# EAGLE design slice_noshift (EAGLE 5.11)

## Sheet 1 of 6
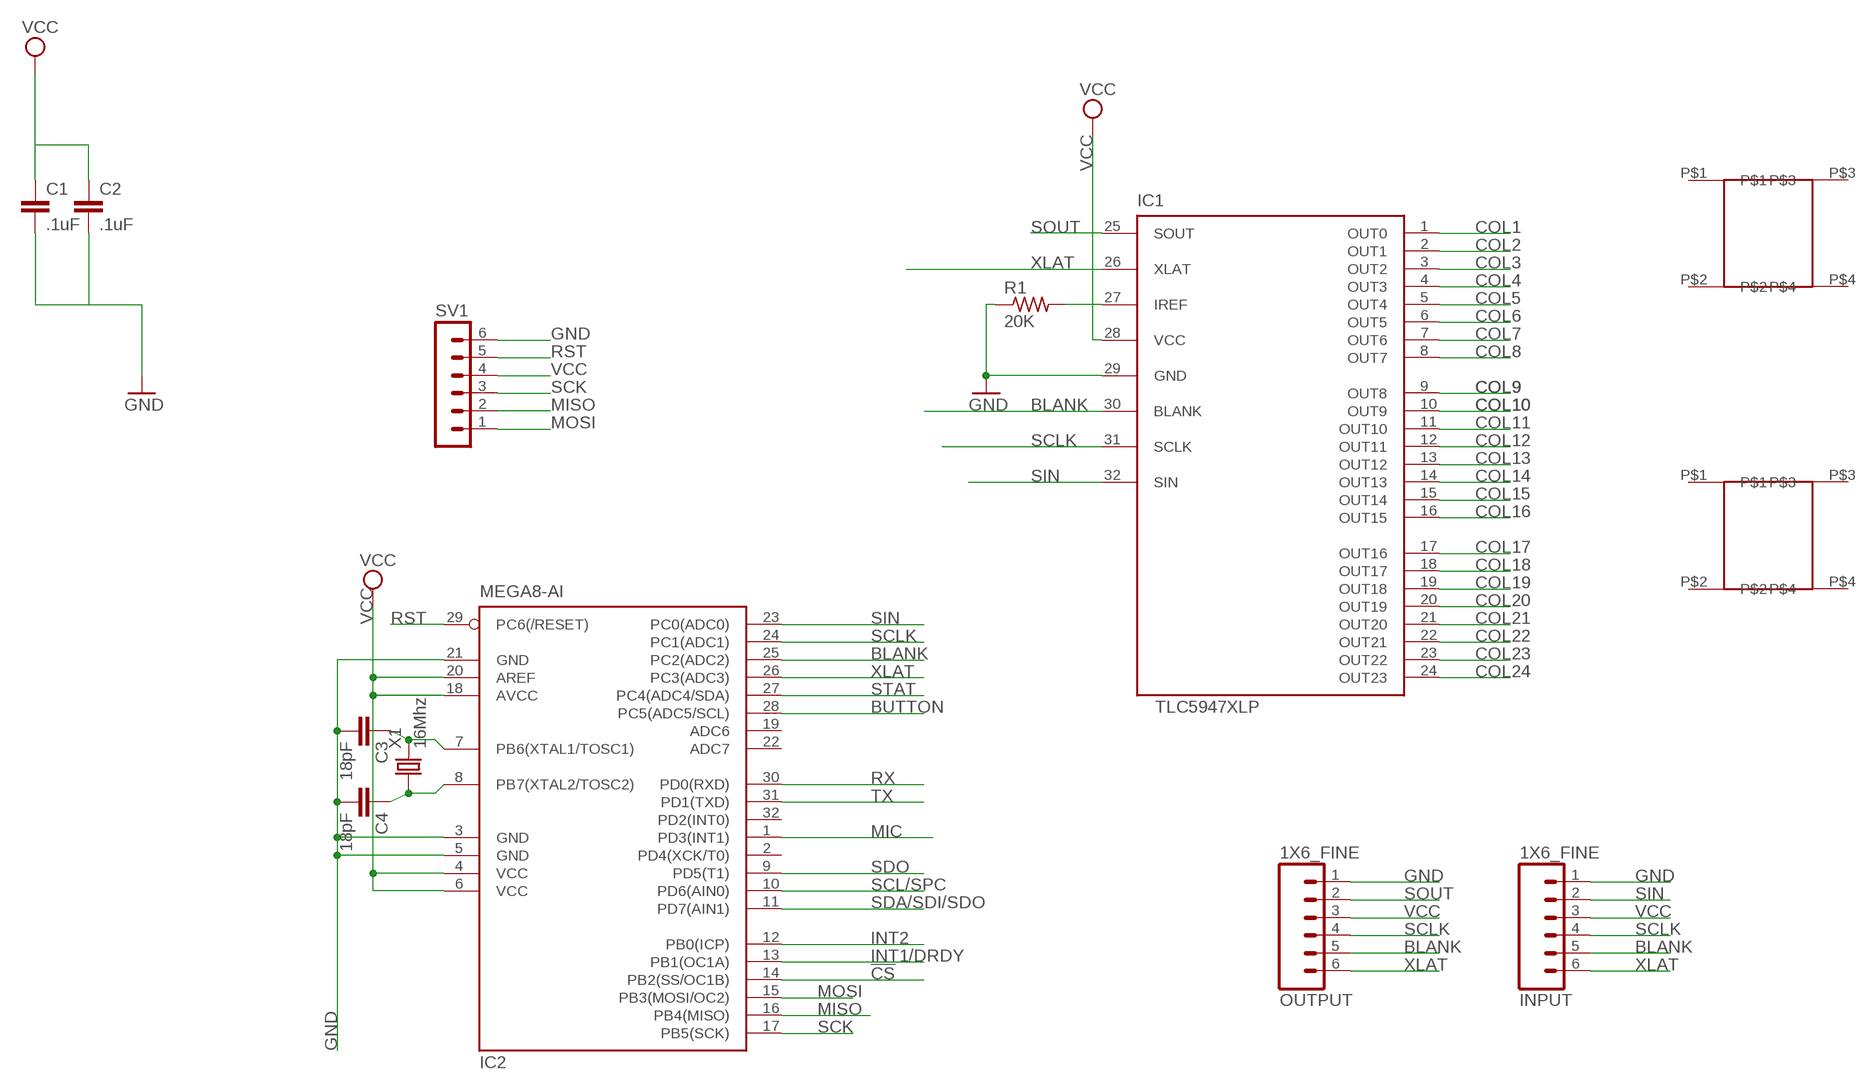
[diagram p0: schematic, sheet 1]

### Parts
C1  .1uF  CAP0805  [0805]
C2  .1uF  CAP0805  [0805]
C3  18pF  CAP0805  [0805]
C4  18pF  CAP0805  [0805]
IC1  TLC5947XLP  [QFN32_XLP]
IC2  MEGA8-AI  [TQFP32-08]
INPUT  1X6_FINE  [1X6_FINE]
OUTPUT  1X6_FINE  [1X6_FINE]
R1  20K  R-US_R0805  [R0805]
SLOT1  SLOT  [SLOT]
SLOT2  SLOT  [SLOT]
SV1  MA06-1  [MA06-1]
X1  16Mhz  CRYSTAL-5032  [5032]

### Nets
!CS: IC2.14(PB2(SS/OC1B)) ; also sheet 3
BLANK: IC1.30(BLANK) IC2.25(PC2(ADC2)) INPUT.5 OUTPUT.5
BUTTON: IC2.28(PC5(ADC5/SCL)) ; also sheet 3
COL1: IC1.1(OUT0) ; also sheet 2
COL2: IC1.2(OUT1) ; also sheet 2
COL3: IC1.3(OUT2) ; also sheet 2
COL4: IC1.4(OUT3) ; also sheet 2
COL5: IC1.5(OUT4) ; also sheet 2
COL6: IC1.6(OUT5) ; also sheet 2
COL7: IC1.7(OUT6) ; also sheet 2
COL8: IC1.8(OUT7) ; also sheet 2
COL9: IC1.9(OUT8) ; also sheet 2
COL10: IC1.10(OUT9) ; also sheet 2
COL11: IC1.11(OUT10) ; also sheet 2
COL12: IC1.12(OUT11) ; also sheet 2
COL13: IC1.13(OUT12) ; also sheet 2
COL14: IC1.14(OUT13) ; also sheet 2
COL15: IC1.15(OUT14) ; also sheet 2
COL16: IC1.16(OUT15) ; also sheet 2
COL17: IC1.17(OUT16) ; also sheet 2
COL18: IC1.18(OUT17) ; also sheet 2
COL19: IC1.19(OUT18) ; also sheet 2
COL20: IC1.20(OUT19) ; also sheet 2
COL21: IC1.21(OUT20) ; also sheet 2
COL22: IC1.22(OUT21) ; also sheet 2
COL23: IC1.23(OUT22) ; also sheet 2
COL24: IC1.24(OUT23) ; also sheet 2
GND: C1.2 C2.2 C3.2 C4.2 IC1.29(GND) IC2.3(GND) IC2.5(GND) IC2.21(GND) INPUT.1 OUTPUT.1 R1.1 SV1.6 ; also sheet 3,4,5,6
INT1/DRDY: IC2.13(PB1(OC1A)) ; also sheet 3
INT2: IC2.12(PB0(ICP)) ; also sheet 3
MIC: IC2.1(PD3(INT1)) ; also sheet 6
MISO: IC2.16(PB4(MISO)) SV1.2
MOSI: IC2.15(PB3(MOSI/OC2)) SV1.1
N$7: C3.1 IC2.7(PB6(XTAL1/TOSC1)) X1.2
N$8: C4.1 IC2.8(PB7(XTAL2/TOSC2)) X1.1
N$13: IC1.27(IREF) R1.2
RST: IC2.29(PC6(/RESET)) SV1.5 ; also sheet 3
RX: IC2.30(PD0(RXD)) ; also sheet 5
SCK: IC2.17(PB5(SCK)) SV1.3
SCL/SPC: IC2.10(PD6(AIN0)) ; also sheet 3
SCLK: IC1.31(SCLK) IC2.24(PC1(ADC1)) INPUT.4 OUTPUT.4
SDA/SDI/SDO: IC2.11(PD7(AIN1)) ; also sheet 3
SDO: IC2.9(PD5(T1)) ; also sheet 3
SIN: IC1.32(SIN) IC2.23(PC0(ADC0)) INPUT.2
SOUT: IC1.25(SOUT) OUTPUT.2
STAT: IC2.27(PC4(ADC4/SDA)) ; also sheet 4
TX: IC2.31(PD1(TXD)) ; also sheet 5
VCC: C1.1 C2.1 IC1.28(VCC) IC2.4(VCC) IC2.6(VCC) IC2.18(AVCC) IC2.20(AREF) INPUT.3 OUTPUT.3 SV1.4 ; also sheet 2,3,4,5,6
XLAT: IC1.26(XLAT) IC2.26(PC3(ADC3)) INPUT.6 OUTPUT.6
Unconnected: IC2.2(PD4(XCK/T0)) IC2.19(ADC6) IC2.22(ADC7) IC2.32(PD2(INT0)) SLOT1.P$1 SLOT1.P$2 SLOT1.P$3 SLOT1.P$4 SLOT2.P$1 SLOT2.P$2 SLOT2.P$3 SLOT2.P$4

## Sheet 2 of 6
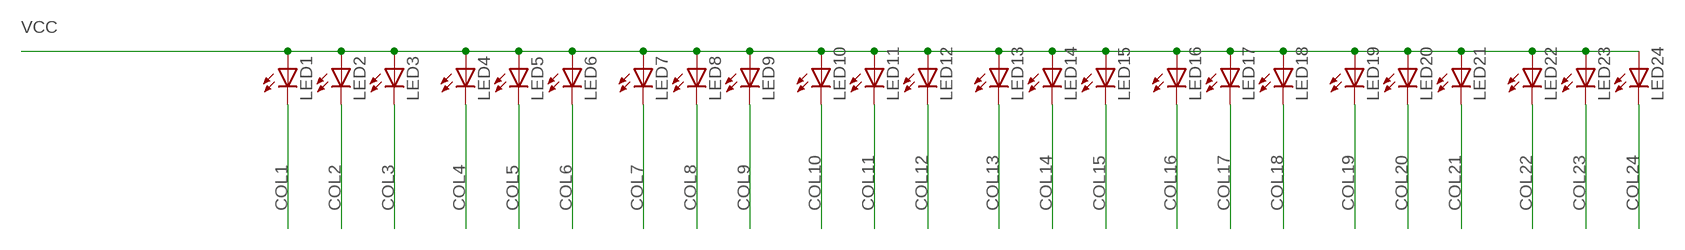
[diagram p1: schematic, sheet 2]

### Parts
LED1  LEDIRL80A  [IRL80A]
LED2  LEDIRL80A  [IRL80A]
LED3  LEDIRL80A  [IRL80A]
LED4  LEDIRL80A  [IRL80A]
LED5  LEDIRL80A  [IRL80A]
LED6  LEDIRL80A  [IRL80A]
LED7  LEDIRL80A  [IRL80A]
LED8  LEDIRL80A  [IRL80A]
LED9  LEDIRL80A  [IRL80A]
LED10  LEDIRL80A  [IRL80A]
LED11  LEDIRL80A  [IRL80A]
LED12  LEDIRL80A  [IRL80A]
LED13  LEDIRL80A  [IRL80A]
LED14  LEDIRL80A  [IRL80A]
LED15  LEDIRL80A  [IRL80A]
LED16  LEDIRL80A  [IRL80A]
LED17  LEDIRL80A  [IRL80A]
LED18  LEDIRL80A  [IRL80A]
LED19  LEDIRL80A  [IRL80A]
LED20  LEDIRL80A  [IRL80A]
LED21  LEDIRL80A  [IRL80A]
LED22  LEDIRL80A  [IRL80A]
LED23  LEDIRL80A  [IRL80A]
LED24  LEDIRL80A  [IRL80A]

### Nets
COL1: LED1.K(C) ; also sheet 1
COL2: LED2.K(C) ; also sheet 1
COL3: LED3.K(C) ; also sheet 1
COL4: LED4.K(C) ; also sheet 1
COL5: LED5.K(C) ; also sheet 1
COL6: LED6.K(C) ; also sheet 1
COL7: LED7.K(C) ; also sheet 1
COL8: LED8.K(C) ; also sheet 1
COL9: LED9.K(C) ; also sheet 1
COL10: LED10.K(C) ; also sheet 1
COL11: LED11.K(C) ; also sheet 1
COL12: LED12.K(C) ; also sheet 1
COL13: LED13.K(C) ; also sheet 1
COL14: LED14.K(C) ; also sheet 1
COL15: LED15.K(C) ; also sheet 1
COL16: LED16.K(C) ; also sheet 1
COL17: LED17.K(C) ; also sheet 1
COL18: LED18.K(C) ; also sheet 1
COL19: LED19.K(C) ; also sheet 1
COL20: LED20.K(C) ; also sheet 1
COL21: LED21.K(C) ; also sheet 1
COL22: LED22.K(C) ; also sheet 1
COL23: LED23.K(C) ; also sheet 1
COL24: LED24.K(C) ; also sheet 1
VCC: LED1.A LED2.A LED3.A LED4.A LED5.A LED6.A LED7.A LED8.A LED9.A LED10.A LED11.A LED12.A LED13.A LED14.A LED15.A LED16.A LED17.A LED18.A LED19.A LED20.A LED21.A LED22.A LED23.A LED24.A ; also sheet 1,3,4,5,6

## Sheet 3 of 6
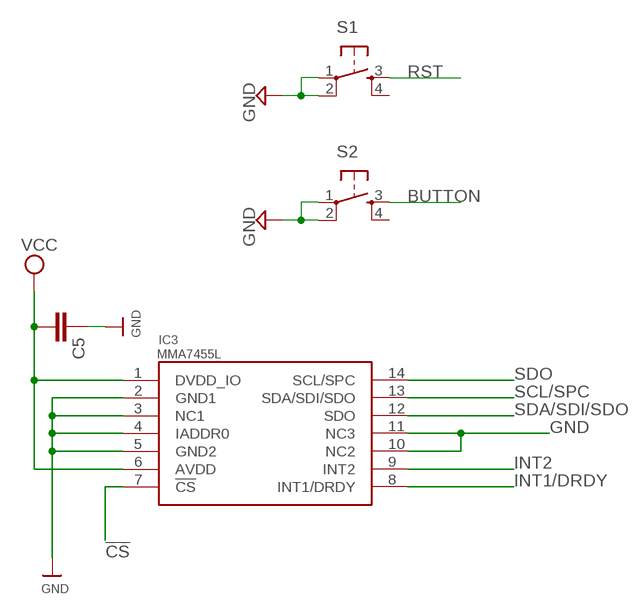
[diagram p2: schematic, sheet 3]

### Parts
C5  CAP0805  [0805]
IC3  MMA7455L  [LGA-14]
S1  TAC_SWITCHSMD  [TACTILE_SWITCH_SMD]
S2  TAC_SWITCHSMD  [TACTILE_SWITCH_SMD]

### Nets
!CS: IC3.7(!CS) ; also sheet 1
BUTTON: S2.3 ; also sheet 1
GND: C5.1 IC3.2(GND1) IC3.3(NC1) IC3.4(IADDR0) IC3.5(GND2) IC3.10(NC2) IC3.11(NC3) S1.1 S1.2 S2.1 S2.2 ; also sheet 1,4,5,6
INT1/DRDY: IC3.8(INT1/DRDY) ; also sheet 1
INT2: IC3.9(INT2) ; also sheet 1
RST: S1.3 ; also sheet 1
SCL/SPC: IC3.13(SDA/SDI/SDO) ; also sheet 1
SDA/SDI/SDO: IC3.12(SDO) ; also sheet 1
SDO: IC3.14(SCL/SPC) ; also sheet 1
VCC: C5.2 IC3.1(DVDD_IO) IC3.6(AVDD) ; also sheet 1,2,4,5,6
Unconnected: S1.4 S2.4

## Sheet 4 of 6
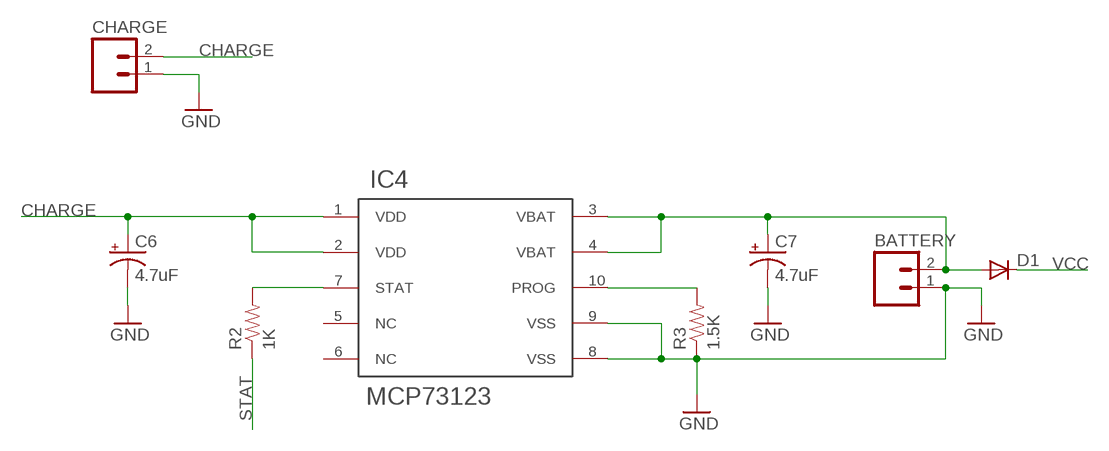
[diagram p3: schematic, sheet 4]

### Parts
BATTERY  M02PTH  [1X02]
C6  4.7uF  CAP_POL3528  [EIA3528]
C7  4.7uF  CAP_POL3528  [EIA3528]
CHARGE  M02-JST-2-PTH-NO_SILK  [JST-2-PTH-NS]
D1  DIODESMA  [SMA-DIODE]
IC4  MCP73123  [DFN10_3X3]
R2  1K  RESISTOR0805  [0805]
R3  1.5K  RESISTOR0805  [0805]

### Nets
CHARGE: C6.A(+) CHARGE.2 IC4.1(VDD) IC4.2(VDD)
GND: BATTERY.1 C6.C(-) C7.C(-) CHARGE.1 IC4.8(VSS) IC4.9(VSS) R3.1 ; also sheet 1,3,5,6
N$1: IC4.7(STAT) R2.2
N$6: IC4.10(PROG) R3.2
STAT: R2.1 ; also sheet 1
VBAT: BATTERY.2 C7.A(+) D1.A IC4.3(VBAT) IC4.4(VBAT)
VCC: D1.C ; also sheet 1,2,3,5,6
Unconnected: IC4.5(NC) IC4.6(NC)

## Sheet 5 of 6
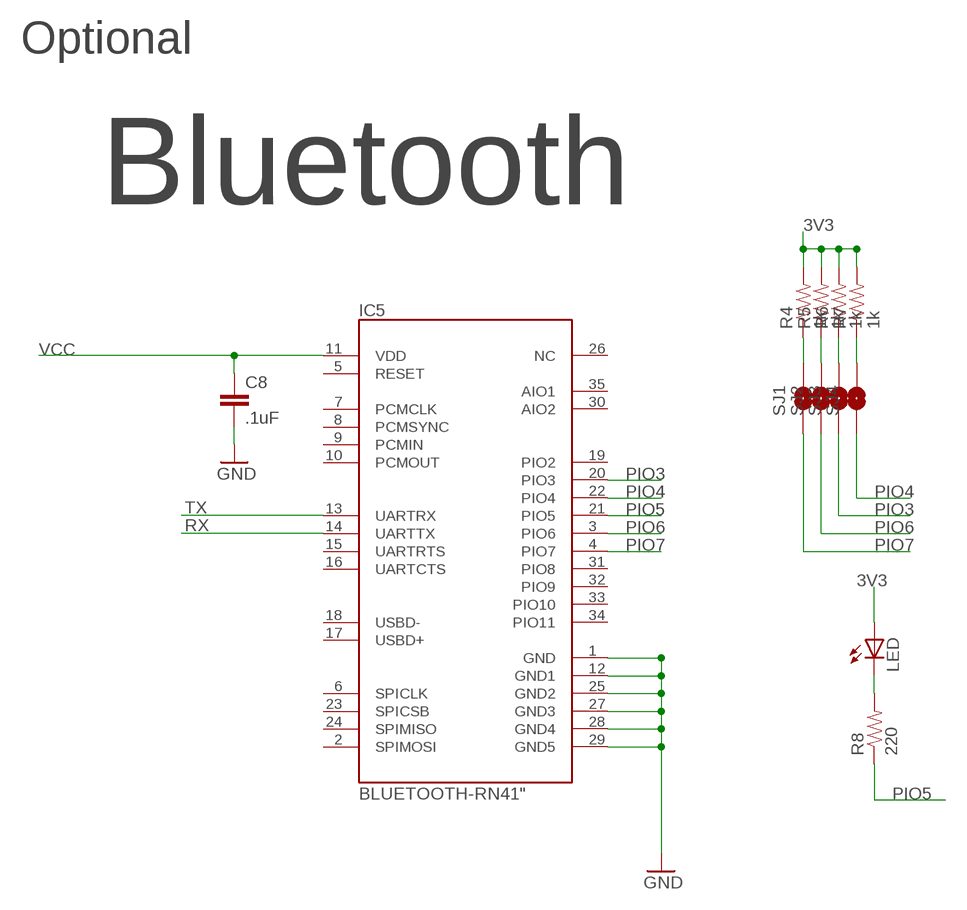
[diagram p4: schematic, sheet 5]

### Parts
C8  .1uF  CAP0805  [0805]
IC5  BLUETOOTH-RN41"  [RN41]
LED  LEDCHIP-LED0603  [CHIP-LED0603]
R4  1k  RESISTOR  [0805]
R5  1k  RESISTOR  [0805]
R6  1k  RESISTOR  [0805]
R7  1k  RESISTOR  [0805]
R8  220  RESISTOR  [0805]
SJ1  SOLDERJUMPERNO  [SJ_2S-NO]
SJ2  SOLDERJUMPERNO  [SJ_2S-NO]
SJ3  SOLDERJUMPERNO  [SJ_2S-NO]
SJ4  SOLDERJUMPERNO  [SJ_2S-NO]

### Nets
3V3: LED.A R4.2 R5.2 R6.2 R7.2
GND: C8.2 IC5.1(GND) IC5.12(GND1) IC5.25(GND2) IC5.27(GND3) IC5.28(GND4) IC5.29(GND5) ; also sheet 1,3,4,6
N$4: LED.C R8.2
N$5: R4.1 SJ1.2
N$21: R6.1 SJ3.2
N$23: R5.1 SJ2.2
N$24: R7.1 SJ4.2
PIO3: IC5.20(PIO3) SJ3.1
PIO4: IC5.22(PIO4) SJ4.1
PIO5: IC5.21(PIO5) R8.1
PIO6: IC5.3(PIO6) SJ2.1
PIO7: IC5.4(PIO7) SJ1.1
RX: IC5.14(UARTTX) ; also sheet 1
TX: IC5.13(UARTRX) ; also sheet 1
VCC: C8.1 IC5.11(VDD) ; also sheet 1,2,3,4,6
Unconnected: IC5.2(SPIMOSI) IC5.5(RESET) IC5.6(SPICLK) IC5.7(PCMCLK) IC5.8(PCMSYNC) IC5.9(PCMIN) IC5.10(PCMOUT) IC5.15(UARTRTS) IC5.16(UARTCTS) IC5.17(USBD+) IC5.18(USBD-) IC5.19(PIO2) IC5.23(SPICSB) IC5.24(SPIMISO) IC5.26(NC) IC5.30(AIO2) IC5.31(PIO8) IC5.32(PIO9) IC5.33(PIO10) IC5.34(PIO11) IC5.35(AIO1)

### Notes on the sheet
- Optional
- Bluetooth

## Sheet 6 of 6
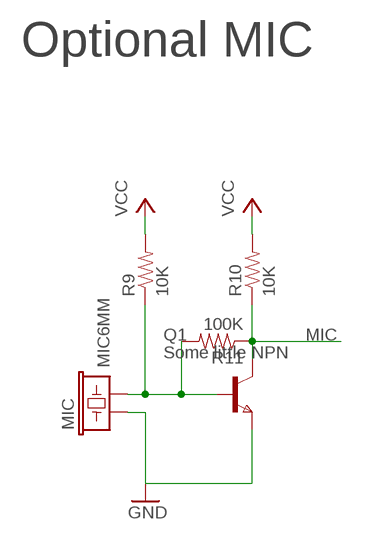
[diagram p5: schematic, sheet 6]

### Parts
MIC  MIC6MM  [MIC-6MM]
Q1  Some little NPN  NPNSOT323  [SOT323]
R9  10K  RESISTOR  [0805]
R10  10K  RESISTOR  [0805]
R11  100K  RESISTOR  [0805]

### Nets
GND: MIC.1 Q1.3(E) ; also sheet 1,3,4,5
MIC: Q1.1(C) R10.1 R11.1 ; also sheet 1
N$3: MIC.2 Q1.2(B) R9.1 R11.2
VCC: R9.2 R10.2 ; also sheet 1,2,3,4,5

### Notes on the sheet
- Optional MIC

## Library data of the parts
BATTERY CHARGE = SparkFun:M02: Header 2 Standard 2-pin 0.1" header. Use with straight break away headers (SKU : PRT-00116), right angle break away headers (PRT-00553), swiss pins (PRT-00743), machine pins (PRT-00117), and female headers (PRT-00115). Molex polarized connector foot print use with SKU : PRT-08233 with associated crimp pins and housings.
C1-C4 = slice_noshift:CAP: Capacitor Standard 0603 ceramic capacitor, and 0.1" leaded capacitor.
C5 C8 = SparkFun:CAP: Capacitor Standard 0603 ceramic capacitor, and 0.1" leaded capacitor.
C6 C7 = slice_noshift:CAP_POL: Capacitor Polarized These are standard SMD and PTH capacitors. Normally 10uF, 47uF, and 100uF in electrolytic and tantalum varieties. Always verify the external diameter of the through hole cap, it varies with capacity, voltage, and manufacturer. The EIA devices should be standard.
D1 = slice_noshift:DIODE: Diode These are standard reverse protection diodes and small signal diodes. SMA package can handle up to about 1A. SOD-323 can handle about 200mA. What the SOD-323 package when ordering, there are some mfgs out there that are 5-pin packages.
IC1 = slice_noshift:TLC5947
IC2 = atmel:MEGA8: MICROCONTROLLER 8 Kbytes FLASH, 1 kbytes SRAM, 512 bytes EEPROM, USART, 6-channel 10 bit ADC, 2-channel 8 bit ADC Pin compatible with Atmega48, ATMega88, ATMega168 Source: avr.lbr; MPN: ATMEGA8-16AU; OC_FARNELL: 9171371; OC_NEWARK: 73M8863
IC3 = MMA7455Lbreakoutboard-v1a:MMA7455L
IC4 = slice_noshift:MCP73123
IC5 = NSL_Mini_Quad:BLUETOOTH-RN41
INPUT OUTPUT = slice_noshift:1X6_FINE
LED LED1-LED24 = led:LED: LED OSRAM: - CHIPLED LG R971, LG N971, LY N971, LG Q971, LY Q971, LO R971, LY R971 LH N974, LH R974 LS Q976, LO Q976, LY Q976 LO Q996 - Hyper CHIPLED LW Q18S LB Q993, LB Q99A, LB R99A - SideLED LS A670, LO A670, LY A670, LG A670, LP A670 LB A673, LV A673, LT A673, LW A673 LH A674 LY A675 LS A676, LA A676, LO A676, LY A676, LW A676 LS A679, LY A679, LG A679 - Hyper Micro SIDELED® LS Y876, LA Y876, LO Y876, LY Y876 LT Y87S - SmartLED LW L88C, LW L88S LB L89C, LB L89S, LG L890 LS L89K, LO L89K, LY L89K LS L896, LA L896, LO L896, LY L896 - TOPLED LS T670, LO T670, LY T670, LG T670, LP T670 LSG T670, LSP T670, LSY T670, LOP T670, LYG T670 LG T671, LOG T671, LSG T671 LB T673, LV T673, LT T673, LW T673 LH T674 LS T676, LA T676, LO T676, LY T676, LB T676, LH T676, LSB T676, LW T676 LB T67C, LV T67C, LT T67C, LS T67K, LO T67K, LY T67K, LW E67C LS E67B, LA E67B, LO E67B, LY E67B, LB E67C, LV E67C, LT E67C LW T67C LS T679, LY T679, LG T679 LS T770, LO T770, LY T770, LG T770, LP T770 LB T773, LV T773, LT T773, LW T773 LH T774 LS E675, LA E675, LY E675, LS T675 LS T776, LA T776, LO T776, LY T776, LB T776 LHGB T686 LT T68C, LB T68C - Hyper Mini TOPLED® LB M676 - Mini TOPLED Santana® LG M470 LS M47K, LO M47K, LY M47K Source: http://www.osram.convergy.de LUXEON: - LUMILED® LXK2-PW12-R00, LXK2-PW12-S00, LXK2-PW14-U00, LXK2-PW14-V00 LXK2-PM12-R00, LXK2-PM12-S00, LXK2-PM14-U00 LXK2-PE12-Q00, LXK2-PE12-R00, LXK2-PE12-S00, LXK2-PE14-T00, LXK2-PE14-U00 LXK2-PB12-K00, LXK2-PB12-L00, LXK2-PB12-M00, LXK2-PB14-N00, LXK2-PB14-P00, LXK2-PB14-Q00 LXK2-PR12-L00, LXK2-PR12-M00, LXK2-PR14-Q00, LXK2-PR14-R00 LXK2-PD12-Q00, LXK2-PD12-R00, LXK2-PD12-S00 LXK2-PH12-R00, LXK2-PH12-S00 LXK2-PL12-P00, LXK2-PL12-Q00, LXK2-PL12-R00 Source: www.luxeon.com KINGBRIGHT: KA-3528ASYC Source: www.kingbright.com
MIC = slice_noshift:MIC: Microphone Omni-directional electret microphone. 9.7mm standard diameter.
Q1 = zetex:NPNSOT323: NPN TRANSISTOR
R1 = rcl:R-US_: RESISTOR, American symbol
R2 R3 = slice_noshift:RESISTOR: Resistor Basic schematic elements and footprints for 0603, 1206, and PTH 1/10th watt (small) resistors.
R4-R11 = SparkFun:RESISTOR: Resistor Basic schematic elements and footprints for 0603, 1206, and PTH 1/10th watt (small) resistors.
S1 S2 = SparkFun:TAC_SWITCH: Momentary Switch Button commonly used for reset or general input. Spark Fun Electronics SKU : COM-00097
SJ1-SJ4 = SparkFun:SOLDERJUMPER: Solder Jumper Standard SMD solder jumper. Used to automate production. Two varients : Normally Open and Normally Closed are the same, but have different paste layers. NC will have a large amount of paste and should jumper during reflow.
SLOT1 SLOT2 = slice:SLOT
SV1 = NSL:MA06-1: PIN HEADER
X1 = NSL_MiniQuad:CRYSTAL*: CRYSTAL

## Board
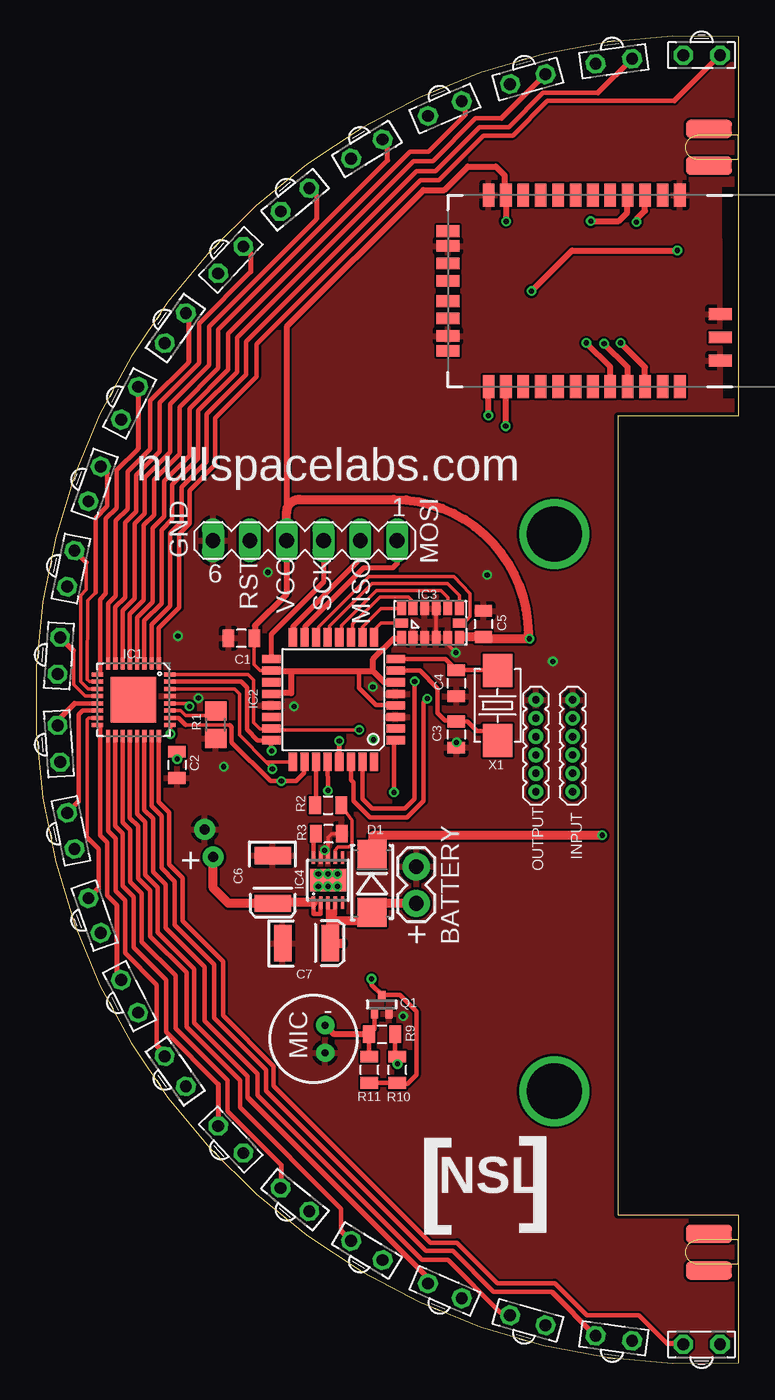
[diagram p6: board, top side]
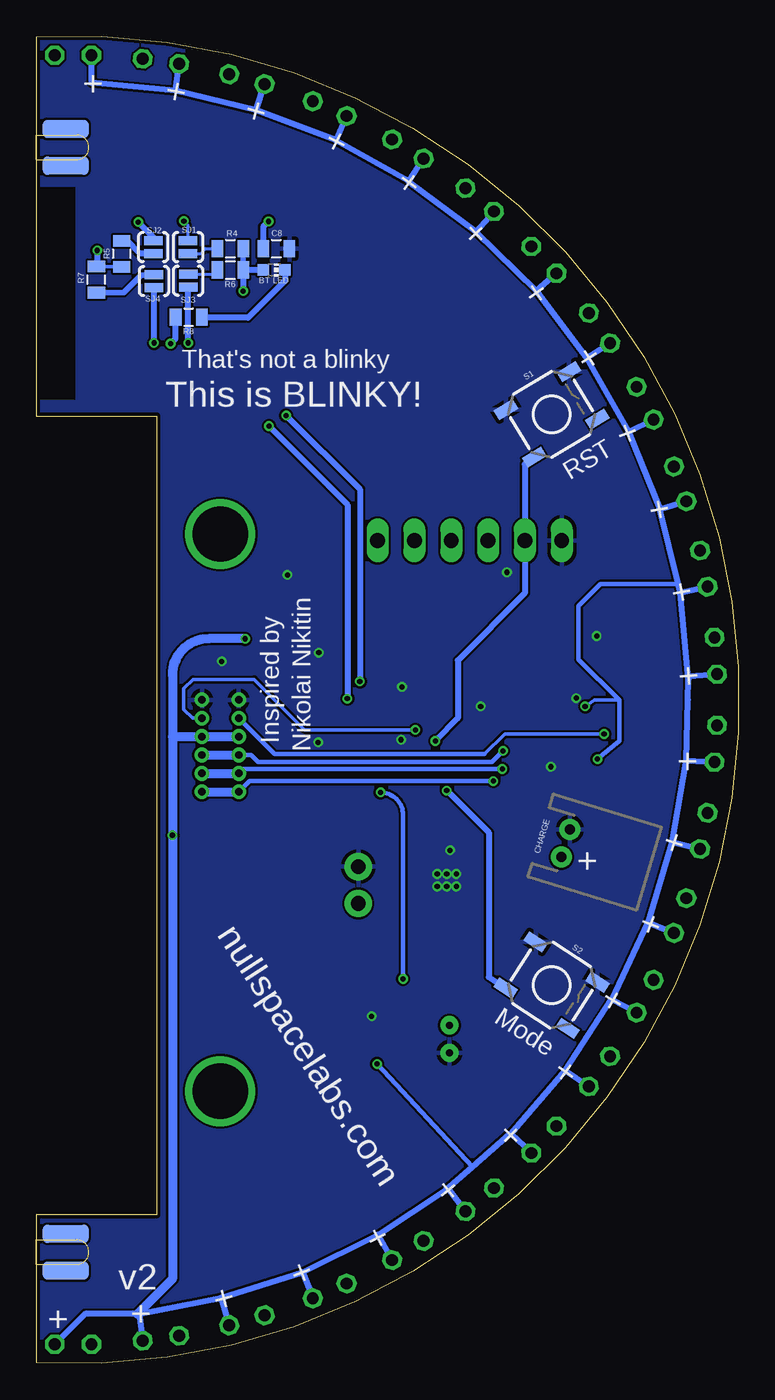
[diagram p7: board, bottom side, seen from below]

Size 48.44 x 91.53 mm. Coordinates in mm from the lower left corner, seen from the top.
Outline: 48.44,91.48 arc187 48.44,0.04 48.44,10.23 40.14,10.23 40.14,65.32 48.44,65.32 48.44,91.48
Copper layers (1*16): Top 0.035mm / dielectric 1.5mm / Bottom 0.035mm
Design rules "ITead_rule": minimum track width 6mil, minimum drill 12mil, track to track 6mil, track to pad 6mil, pad to pad 6mil, via to via 6mil, smd to smd 0mil, copper to edge 10mil, drill to drill 10mil, minimum pad ring 10mil, minimum via ring 6mil, stop-mask expansion 2mil, vias tented up to drill 100mil, thermal gap 10mil

### Footprints (pad centres in the part's own frame; a part is rotated, then mirrored left to right if it is on the bottom)
1X02 = drill 1.016 pad 1.88 round: 1 0,0; 2 2.54,0
0805 = smd 0.8 x 1.2: 1 -0.9,0; 2 0.9,0
EIA3528 = smd 1.2 x 2.5: A 1.65,0; C -1.65,0
JST-2-PTH-NS = drill 0.7 pad 1.448 round: 1 -1,0; 2 1,0
SMA-DIODE = smd 2 x 2: A -2,0; C 2,0
QFN32_XLP = smd 0.285 x 0.8: 1 -1.75,-2.5; 2 -1.25,-2.5; 3 -0.75,-2.5; 4 -0.25,-2.5; 5 0.25,-2.5; 6 0.75,-2.5; 7 1.25,-2.5; 8 1.75,-2.5; 17 1.75,2.5; 18 1.25,2.5; 19 0.75,2.5; 20 0.25,2.5; 21 -0.25,2.5; 22 -0.75,2.5; 23 -1.25,2.5; 24 -1.75,2.5 | smd 0.8 x 0.285: 9 2.5,-1.75; 10 2.5,-1.25; 11 2.5,-0.75; 12 2.5,-0.25; 13 2.5,0.25; 14 2.5,0.75; 15 2.5,1.25; 16 2.5,1.75; 25 -2.5,1.75; 26 -2.5,1.25; 27 -2.5,0.75; 28 -2.5,0.25; 29 -2.5,-0.25; 30 -2.5,-0.75; 31 -2.5,-1.25; 32 -2.5,-1.75 | smd 3.15 x 3.15: EP 0,0
TQFP32-08 = smd 1.27 x 0.559: 1 -4.293,2.8; 2 -4.293,2; 3 -4.293,1.2; 4 -4.293,0.4; 5 -4.293,-0.4; 6 -4.293,-1.2; 7 -4.293,-2; 8 -4.293,-2.8; 17 4.293,-2.8; 18 4.293,-2; 19 4.293,-1.2; 20 4.293,-0.4; 21 4.293,0.4; 22 4.293,1.2; 23 4.293,2; 24 4.293,2.8 | smd 0.559 x 1.27: 9 -2.8,-4.293; 10 -2,-4.293; 11 -1.2,-4.293; 12 -0.4,-4.293; 13 0.4,-4.293; 14 1.2,-4.293; 15 2,-4.293; 16 2.8,-4.293; 25 2.8,4.293; 26 2,4.293; 27 1.2,4.293; 28 0.4,4.293; 29 -0.4,4.293; 30 -1.2,4.293; 31 -2,4.293; 32 -2.8,4.293
LGA-14 = smd 0.6 x 0.9: 1 -2,-1; 2 -1.2,-1; 3 -0.4,-1; 4 0.4,-1; 5 1.2,-1; 6 2,-1; 8 2,1; 9 1.2,1; 10 0.4,1; 11 -0.4,1; 12 -1.2,1; 13 -2,1 | smd 0.9 x 0.6: 7 2,0; 14 -2,0
DFN10_3X3 = smd 0.3 x 0.85: 1 -1,-1.55; 2 -0.5,-1.55; 3 0,-1.55; 4 0.5,-1.55; 5 1,-1.55; 6 1,1.55; 7 0.5,1.55; 8 0,1.55; 9 -0.5,1.55; 10 -1,1.55 | smd 2.48 x 1.55: EXP 0,0
RN41 = smd 0.8 x 1.6: 1 -6.6,-6.6; 2 -5.4,-6.6; 3 -4.2,-6.6; 4 -3,-6.6; 5 -1.8,-6.6; 6 -0.6,-6.6; 7 0.6,-6.6; 8 1.8,-6.6; 9 3,-6.6; 10 4.2,-6.6; 11 5.4,-6.6; 12 6.6,-6.6; 13 6.6,6.6; 14 5.4,6.6; 15 4.2,6.6; 16 3,6.6; 17 1.8,6.6; 18 0.6,6.6; 19 -0.6,6.6; 20 -1.8,6.6; 21 -3,6.6; 22 -4.2,6.6; 23 -5.4,6.6; 24 -6.6,6.6 | smd 1.6 x 0.8: 25 -9.4,4.8; 26 -9.4,3.2; 27 -9.4,1.6; 28 9.4,3.1; 29 9.4,-3.1; 30 9.4,-4.122; 31 9.4,-1.9; 32 9.4,-0.7; 33 9.4,0.7; 34 9.4,1.9; 35 9.4,4.122
1X6_FINE = drill 0.508 pad 1 round: 1 0,0; 2 1.27,0; 3 2.54,0; 4 3.81,0; 5 5.08,0; 6 6.35,0
CHIP-LED0603 = smd 0.8 x 0.8: A 0,-0.75; C 0,0.75
IRL80A = drill 0.813 octagon: A 0,-1.27; K 0,1.27
MIC-6MM = drill 0.5 pad 1.27 round: 1 -0.8,0.95; 2 -0.8,-0.95
SOT323 = smd 0.6 x 0.5: 1 -0.65,0; 2 0.65,-0.5; 3 0.65,0.5
R0805 = smd 1.3 x 1.5: 1 -0.95,0; 2 0.95,0
TACTILE_SWITCH_SMD = smd 1.524 x 0.762: 1 -2.54,1.905; 2 2.54,1.905; 3 -2.54,-1.905; 4 2.54,-1.905
SJ_2S-NO = smd 0.635 x 1.27: 1 -0.45,0; 2 0.45,0
SLOT = smd 3.175 x 1.27: P$1 2.032,1.27; P$2 2.032,-1.27 | smd 3.175 x 1.27 bottom: P$3 2.032,1.27; P$4 2.032,-1.27
MA06-1 = drill 1.016 long: 1 -6.35,0; 2 -3.81,0; 3 -1.27,0; 4 1.27,0; 5 3.81,0; 6 6.35,0
5032 = smd 2.286 x 2.032: 1 -2.413,0; 2 2.413,0

### Placement (x,y rotation side)
BATTERY  26.22,34.26 270 top
C1  14.15,50.01 180 top
C2  9.71,41.27 270 top
C3  [0805]  28.98,43.36 270 top
C4  [0805]  28.99,46.9 270 top
C5  30.85,50.99 270 top
C6  16.31,33.37 270 top
C7  18.65,28.97 0 top
C8  31.88,76.88 0 bottom
CHARGE  11.92,35.87 253 bottom
D1  23.17,33.09 90 top
IC1  6.71,45.76 180 top
IC2  20.5,45.77 180 top
IC3  27.19,51.06 0 top
IC4  20.12,33.32 0 top
IC5  37.8,73.96 180 top
INPUT  37.01,45.76 270 top
LED  32.04,75.41 270 bottom
LED1  45.9,90.21 270 top
LED2  39.85,89.8 277.8 top
LED3  33.91,88.57 285.7 top
LED4  28.2,86.53 293.5 top
LED5  22.81,83.74 301.3 top
LED6  17.85,80.24 309.1 top
LED7  13.42,76.1 317 top
LED8  9.59,71.4 324.8 top
LED9  6.44,66.21 332.6 top
LED10  4.02,60.65 340.4 top
LED11  2.38,54.81 348.3 top
LED12  1.56,48.8 356.1 top
LED13  1.56,42.73 3.9 top
LED14  2.38,36.72 11.7 top
LED15  4.02,30.88 19.6 top
LED16  6.44,25.31 27.4 top
LED17  9.59,20.13 35.2 top
LED18  13.42,15.42 43 top
LED19  17.85,11.28 50.9 top
LED20  22.81,7.79 58.7 top
LED21  28.19,4.99 66.5 top
LED22  33.91,2.96 74.3 top
LED23  39.85,1.73 82.2 top
LED24  45.9,1.31 90 top
MIC  19.13,22.36 180 top
OUTPUT  34.47,45.76 270 top
Q1  23.85,24.75 270 top
R1  [R0805]  12.39,44.04 90 top
R2  [0805]  20.14,38.5 0 top
R3  [0805]  20.17,36.52 180 top
R4  35.06,76.88 0 bottom
R5  42.55,76.52 270 bottom
R6  35.06,75.41 0 bottom
R7  44.3,74.74 90 bottom
R8  37.93,72.15 0 bottom
R9  23.86,22.69 0 top
R10  24.91,20.24 90 top
R11  22.98,20.24 90 top
S1  12.88,65.45 31 bottom
S2  12.88,26.08 327 bottom
SJ1  37.98,76.98 270 bottom
SJ2  40.37,76.98 270 bottom
SJ3  37.95,74.67 90 bottom
SJ4  40.32,74.64 90 bottom
SLOT1  48.44,83.86 180 top
SLOT2  48.44,7.66 180 top
SV1  18.54,56.75 180 top
X1  [5032]  31.82,45.37 270 top

### Tracks (layer width: path | path; a pad name or v marks a point on that pad's centre or on a via)
3V3  (via drill 0.36)
  Top 0.406: v44.23,76.75 36.96,76.75 v34.17,73.96
  Bottom 0.203: R7.2 44.28,75.62 R5.2 44.22,75.62 44.23,75.63 | R6.2 34.17,75.39
  Bottom 0.381: R6.2 R4.2
  Bottom 0.406: LED.A R6.2 | v44.23,76.75 44.23,75.63 | 34.17,75.39 v34.17,73.96
!CS
  Top 0.203: IC2.14 19.27,50.1
  Top 0.254: IC2.14 19.46,50.22 19.46,50.77 22.94,54.25 28.81,54.25 29.93,53.08 29.93,51.5 29.54,51.06 IC3.7
BLANK  (via drill 0.36)
  Top 0.203: IC1.30 9.02,46.53
  Top 0.254: IC1.30 9.23,46.5 13.7,46.5 14.03,46.17 14.03,43.33 15.87,41.48 | 15.87,41.48 IC2.25 | v16.29,40.99 16.34,41.01 15.87,41.48
  Bottom 0.254: 34.37,40.79 OUTPUT.5 34.17,40.99
  Bottom 0.305: 34.17,40.99 v16.29,40.99
  Bottom 0.61: INPUT.5 OUTPUT.5
BUTTON  (via drill 0.36)
  Top 0.305: v20.12,39.5 IC2.28
  Bottom 0.406: v20.12,39.5 17.22,36.59 17.22,26.64 S2.3
CHARGE
  Top 0.305: IC4.2 19.62,31.01 19.12,31.01 IC4.1 | 16.31,31.77 C6.A
  Top 0.61: IC4.1 16.31,31.77 | CHARGE.2 12.21,32.78 13.27,31.73 16.3,31.73 C6.A
COL1
  Top 0.305: IC1.1 8.46,50.71 9.86,52.11 9.86,57.19 10.57,57.9 10.57,60.19 12.35,61.97 12.35,65.19 15.2,68.04 15.2,70.3 26.5,81.6 27.77,81.6 30.84,84.68 32.87,84.68 35.26,87.06 44.02,87.06
  Top 0.356: 44.02,87.06 LED1.K
COL2
  Top 0.305: IC1.2 7.96,50.95 9.23,52.22 9.23,57.27 10.01,58.06 10.01,60.44 11.77,62.2 11.77,65.47 14.48,68.19 14.48,70.45 26.24,82.21 27.54,82.21 30.59,85.26 32.59,85.26 34.96,87.62 38.76,87.62
  Top 0.356: 38.76,87.62 LED2.K
COL3
  Top 0.305: IC1.3 7.46,51.21 8.64,52.39 8.64,57.47 9.38,58.21 9.38,60.6 11.18,62.4 11.18,65.7 13.85,68.37 13.85,70.73 26.04,82.92 27.36,82.92 30.31,85.87 32.1,85.87
  Top 0.356: 32.1,85.87 LED3.K
COL4
  Top 0.305: IC1.4 6.96,51.45 8.03,52.52 8.03,57.6 8.82,58.39 8.82,60.85 10.57,62.6 10.57,65.85 13.24,68.52 13.24,71.01 25.79,83.56 27.06,83.56 29.6,86.1
  Top 0.356: 29.6,86.1 29.6,86.8 LED4.K
COL5
  Top 0.305: IC1.5 6.46,51.69 7.42,52.65 7.42,57.8 8.13,58.51 8.13,60.95 9.89,62.71 9.89,65.96 12.55,68.62 12.55,71.29 24.24,82.97
  Top 0.356: 24.24,82.97 24.24,84.06 LED5.K
COL6
  Top 0.305: IC1.6 5.96,51.92 6.79,52.75 6.79,57.9 7.47,58.59 7.47,61.08 9.23,62.83 9.23,66.16 11.92,68.85 11.92,71.49 19.34,78.91
  Top 0.356: 19.34,78.91 19.34,80.55 LED6.K
COL7
  Top 0.305: IC1.7 5.46,52.16 6.13,52.82 6.13,57.98 6.89,58.74 6.89,61.26 8.52,62.88 8.52,66.26 11.23,68.98 11.23,71.72 14.79,75.28
  Top 0.356: 14.79,75.28 14.79,76.53 LED7.K
COL8
  Top 0.305: IC1.8 4.96,52.4 5.49,52.93 5.49,58.11 6.31,58.92 6.31,61.49 7.86,63.04 7.86,66.39 10.5,69.03
  Top 0.356: 10.5,69.03 10.5,72.26 LED8.K
COL9
  Top 0.305: 7.02,63.06 5.54,61.59 5.54,59 4.81,58.26 4.81,53.08 4.41,52.68 4.41,47.71 IC1.9 | LED9.K
  Top 0.356: LED9.K 7.02,63.06
COL10
  Top 0.254: IC1.10 3.72,47.01 3.69,47.01 3.51,47.16 3.54,52.6 4.1,53.15
  Top 0.305: 4.1,53.15 4.1,58.31 4.91,59.12 4.91,61.38
  Top 0.356: LED10.K 4.91,61.38
COL11
  Top 0.254: IC1.11 3.57,46.51 3.05,47.03 3.05,52.95 3.46,53.36 3.46,55.23
  Top 0.356: LED11.K 3.46,55.23
COL12
  Top 0.254: IC1.12 3.39,46.01 2.57,46.83 2.57,49.14
  Top 0.356: LED12.K 2.57,49.14
COL13
  Top 0.203: IC1.13 4.41,45.51
  Top 0.305: 4.41,45.51 2.64,45.51
  Top 0.356: 2.64,45.51 1.47,44.34 LED13.K
COL14
  Top 0.305: 2.93,38.77 2.93,44.75 3.19,45.01 IC1.14
  Top 0.356: 2.93,38.77 LED14.K
COL15
  Top 0.254: IC1.15 3.63,44.51 3.51,44.39 3.51,36.26
  Top 0.305: 3.51,36.26 4.3,35.48 4.3,32.78
  Top 0.356: 4.3,32.78 LED15.K
COL16
  Top 0.305: 5.54,31.62 4.91,32.25 4.91,35.91 4.41,36.41 4.41,43.81 IC1.16
  Top 0.356: 5.54,31.62 5.54,26.75 LED16.K
COL17
  Top 0.305: IC1.17 4.96,36.72 5.47,36.21 5.47,32.58 6.13,31.92 6.13,28.29 8.31,26.1 8.31,21.91
  Top 0.356: 8.31,21.91 8.86,21.37 LED17.K
COL18
  Top 0.305: IC1.18 5.46,37.06 5.98,36.54 5.98,32.91 6.71,32.17 6.71,28.67 8.95,26.43 8.95,22.85 12.55,19.25
  Top 0.356: 12.55,19.25 LED18.K
COL19
  Top 0.305: IC1.19 5.96,37.29 6.48,36.77 6.48,33.19 7.27,32.4 7.27,29.08 9.61,26.74 9.61,23.11 13.21,19.5 13.21,17.37 16.9,13.68 | 16.9,12.12 LED19.K
  Top 0.356: 16.9,13.68 16.9,12.12
COL20
  Top 0.305: IC1.20 6.46,37.61 7.02,37.05 7.02,33.44 7.86,32.61 7.86,29.46 10.37,26.94 10.37,23.21 14.05,19.53 14.05,17.65 21.04,10.66 21.04,9.13
  Top 0.356: 21.04,9.13 LED20.K
COL21
  Top 0.305: IC1.21 6.96,37.89 7.53,37.33 7.53,33.67 8.36,32.83 8.36,29.71 10.88,27.2 10.88,23.49 14.59,19.78 14.59,18.33
  Top 0.356: LED21.K 26.88,5.65 26.88,6.04 14.59,18.33
COL22
  Top 0.305: IC1.22 7.46,38.16 8.06,37.56 8.06,33.9 8.92,33.04 8.92,30.04 11.61,27.35 11.61,23.61 15.27,19.96 15.27,18.48 26.63,7.13 28.4,7.13 32.04,3.5
  Top 0.356: 32.04,3.5 32.5,3.5 LED22.K
COL23
  Top 0.305: IC1.23 7.96,38.44 8.64,37.76 8.64,34.16 9.56,33.24 9.56,30.24 12.27,27.53 12.27,23.82 15.86,20.24 15.86,18.79 26.91,7.74 28.73,7.74 31.55,4.92 35.57,4.92
  Top 0.356: 35.57,4.92 LED23.K
COL24
  Top 0.305: IC1.24 8.46,38.71 9.18,37.99 9.18,34.41 10.12,33.47 10.12,30.5 12.88,27.73 12.88,24 16.39,20.49 16.39,19.12 27.18,8.32 29.04,8.32 31.83,5.53 35.77,5.53 38.01,3.29 41.59,3.29 43.52,1.36
  Top 0.356: 43.52,1.36 44.58,1.36 LED24.K
GND  (via drill 0.36)
  Top 0.203: IC2.5 24.65,46.32
  Top 0.254: v28.95,49.01 28.39,49.57 IC3.5 | IC3.10 IC3.4 | IC1.29 | IC4.8 20.12,36.26 20.38,36.52 R3.1
  Top 0.305: IC2.3 24.83,44.54
  other vias: 23.27,43 17.78,45.31 23.21,46.65 31.11,54.37 29,42.82 9.78,50.16 19.46,33.75 20.12,33.75 20.78,33.75 20.78,32.89 20.12,32.89 19.46,32.89 12.94,41.14 25.31,23.93 11.19,45.88 35.65,48.4 15.97,54.55 19.9,35.37
  pour Top: 49.08,81.25 47.1,81.32 47.15,66.39 49.13,66.36 49.79,66.36 49.44,-1.63 -3.5,-1.63 -3.5,93.9 49.05,93.9
  pour Bottom: -4.41,95.34 49.97,95.34 50.22,81.3 45.57,81.3 45.57,66.29 51.11,66.29 50.68,-2.85 -4.41,-2.85
INT1/DRDY
  Top 0.203: 20.12,50.08 IC2.13
  Top 0.254: 20.12,50.08 20.25,50.21 20.25,50.84 23.17,53.76 28.38,53.76 29.19,52.95 IC3.8
INT2
  Top 0.203: IC2.12 20.88,50.09
  Top 0.254: IC2.12 21.06,50.22 21.06,50.87 23.48,53.28 27.92,53.28 28.39,52.81 IC3.9
MIC  (via drill 0.36)
  Top 0.305: IC2.1 arc90 24.68,42.86 v24.68,39.38 | v23.13,26.51 23.13,26.11 Q1.1 25.09,25.39 26.22,24.26 26.22,19.88 25.62,19.28 24.96,19.28 R10.1 R11.1
  Bottom 0.305: v24.68,39.38 arc90 23.13,37.83 v23.13,26.51
MISO
  Top 0.203: 17.67,50.1 IC2.16
  Top 0.356: 17.67,50.1 17.69,50.11 17.69,50.79 22.35,55.46 SV1.2
MOSI
  Top 0.203: IC2.15
  Top 0.356: IC2.15 18.52,50.08 18.52,50.79 22.59,54.86 24.59,54.86 24.89,55.16 SV1.1
N$1
  Top 0.254: IC4.7 20.62,35.28 20.61,35.3 20.61,35.37 20.83,35.6 21.57,35.6 21.8,35.83 21.8,37.44 R2.2
N$2  (via drill 3.81)
  other vias: 35.74,18.76
N$3
  Top 0.305: R11.2 22.96,21.16 R9.1 23.34,23.07 Q1.2
  Top 0.406: MIC.2 20.55,22.69 R9.1
N$4
  Bottom 0.203: 36.98,72.1 R8.2
  Bottom 0.406: LED.C 31.29,74.66 33.84,72.1 36.98,72.1
N$5
  Bottom 0.203: SJ1.2 37.97,76.52 37.12,76.52 36.76,76.88 R4.1
N$6
  Top 0.305: IC4.10 arc90 19.13,34.88 19.13,36 arc-90 R3.2
N$7
  Top 0.203: C3.1 28.95,44.34 | 31.81,43.86 31.81,43.6 31.81,42.97 X1.2
  Top 0.305: IC2.7 26.47,47.77 27.69,46.55 27.69,44.85 28.2,44.34 28.95,44.34 | C3.1 29.75,44.26 30.41,43.6 31.81,43.6
N$8
  Top 0.203: 24.81,48.58 IC2.8 | X1.1 31.76,47.85
  Top 0.305: 24.81,48.58 28.25,48.58 C4.1 31.81,47.8 X1.1
N$9  (via drill 3.81)
  other vias: 35.74,57.19
N$13
  Top 0.203: IC1.27 9.02,45.01
  Top 0.254: IC1.27 9.22,45 9.25,45.03 9.96,45.03 10.32,44.67 11.77,44.67 12.04,44.95 R1.2
N$21
  Bottom 0.203: SJ3.2 36.25,75.12 arc-90 R6.1
N$23
  Bottom 0.203: SJ2.2 40.39,76.55 | 42.18,77.42 R5.1
  Bottom 0.406: 40.39,76.55 41.31,76.55 42.18,77.42
N$24
  Bottom 0.203: 44.29,73.86 R7.1
  Bottom 0.381: 44.29,73.86 42.4,73.86 41.21,75.05 40.36,75.05 SJ4.2
PIO3  (via drill 0.36)
  Top 0.406: IC5.20 39.6,68.73 v37.95,70.38
  Bottom 0.406: v37.95,70.38 SJ3.1
PIO4  (via drill 0.36)
  Top 0.406: IC5.22 42,68.69 v40.32,70.38
  Bottom 0.406: v40.32,70.38 SJ4.1
PIO5  (via drill 0.36)
  Top 0.381: 40.8,68.7
  Top 0.406: 40.8,68.7 v39.17,70.33 | IC5.21 40.8,68.7
  Bottom 0.406: v39.17,70.33 38.83,70.67 R8.1
PIO6  (via drill 0.36)
  Top 0.203: 41.99,80.55 IC5.3 | v41.41,78.71 41.41,78.91
  Top 0.406: 41.99,80.55 41.99,79.49 41.41,78.91
  Bottom 0.203: SJ2.1 40.37,77.67
  Bottom 0.406: 40.37,77.67 v41.41,78.71
PIO7  (via drill 0.36)
  Top 0.203: 40.77,80.53 IC5.4
  Top 0.406: 40.77,80.53 40.77,79.37 40.19,78.78 v38.26,78.78
  Bottom 0.203: v38.26,78.78 37.98,78.5 SJ1.1
RST  (via drill 0.36)
  Top 0.356: IC2.29 20.9,42.95 v20.91,42.92
  Bottom 0.356: SV1.5 14.64,56.65
  Bottom 0.406: v20.91,42.92 19.36,44.49 19.36,48.48 14.73,53.11 SV1.5 14.73,62.01 S1.3
RX  (via drill 0.36)
  Top 0.203: IC5.14 32.44,67.32
  Top 0.305: IC2.30 21.7,40.25 21.9,40.05 21.9,38.78 23.04,37.64 25.58,37.64 26.73,38.78 26.73,45.59 v26.98,45.84
  Top 0.406: v32.39,64.64 32.39,67.35 IC5.14
  Bottom 0.406: v26.98,45.84 26.98,59.23 v32.39,64.64
SCK
  Top 0.203: IC2.17
  Top 0.356: SV1.3 19.81,53.87 16.21,50.27 IC2.17
SCL/SPC
  Top 0.203: IC2.10
  Top 0.254: IC2.10 22.51,50.08 22.51,50.79 23.78,52.06 IC3.13
SCLK  (via drill 0.36)
  Top 0.203: IC1.31 9.02,47.01
  Top 0.305: IC1.31 14.12,47.01 14.54,46.6 14.54,43.71 15.27,42.97 IC2.24 | IC2.24 | IC2.24 16.21,42.26 v16.24,42.23
  Bottom 0.305: v16.24,42.23 17,41.47 33.15,41.47 33.64,41.95 OUTPUT.4
  Bottom 0.61: INPUT.4 OUTPUT.4
SDA/SDI/SDO
  Top 0.203: IC2.11
  Top 0.254: IC2.11 21.83,50.19 21.83,50.97 23.7,52.85 25.69,52.85 25.99,52.54 IC3.12
SDO
  Top 0.254: IC2.9 23.3,50.59 23.77,51.06 IC3.14
SIN  (via drill 0.36)
  Top 0.203: IC1.32 9.02,47.52 | 16.24,43.75 IC2.23
  Top 0.254: IC1.32 14.61,47.51 14.99,47.14 14.99,44.19 15.45,43.73 15.47,43.75 16.24,43.75 16.3,43.68 v22.28,43.68
  Bottom 0.254: INPUT.2 37.65,44.49 38.26,45.1 38.26,46.53 37.62,47.16 33.41,47.16 29.93,43.68 v22.28,43.68
SOUT  (via drill 0.36)
  Top 0.203: IC1.25 9.01,44.01
  Top 0.254: IC1.25 9.27,44.01 v9.27,43.4
  Bottom 0.254: v9.27,43.4 16.12,43.4 17.51,42.02
  Bottom 0.305: 17.51,42.02 32,42.02 OUTPUT.2
STAT
  Top 0.254: 19.3,38.25 R2.1
  Top 0.305: IC2.27 19.3,38.25
TX  (via drill 0.36)
  Top 0.203: IC2.31 22.49,41.48 | v26.12,47.03 26.07,46.98
  Top 0.254: v26.12,47.03 26.14,47.01
  Top 0.305: IC2.31 22.5,38.94 23.17,38.27 25.46,38.27 26.09,38.91 26.09,47.01 v26.12,47.03
  Top 0.406: v31.2,65.37 IC5.13
  Bottom 0.406: v26.12,47.03 26.12,60.29 v31.2,65.37
VBAT
  Top 0.305: IC4.3 20.12,31.01 20.45,31.01 20.63,31.01 IC4.4
  Top 0.61: 20.3,30.52 20.3,31.01 20.45,31.01 | 20.3,30.52 C7.A 21.06,28.97 | BATTERY.2 23.8,31.72 arc90 D1.A 23.1,31.09 22.51,30.5 20.33,30.5 20.3,30.52
VCC  (via drill 0.36)
  Top 0.203: IC2.20 16.25,46.22 16.26,46.22 | IC2.18 16.24,47.74 | IC2.6 24.78,46.96 24.04,46.96 | IC5.11 32.52,80.67
  Top 0.254: 29.22,50.09 IC3.6 | IC2.18 15.45,47.77 15.02,48.2 15.02,49.92 C1.1 | IC1.28 10.57,45.51 v10.57,45.31 | C2.1 9.72,42.21 v9.72,41.67
  Top 0.305: IC2.4 24.76,45.41 23.43,45.41 22.26,46.58 22.26,47.69 22.31,47.74 | R9.2 24.76,21.29 R10.2 24.91,20.66 v24.92,20.64
  Top 0.406: 23.25,47.74 24.04,46.96 | 17.56,47.74 16.24,47.74 16.27,47.77 | 23.25,47.74 22.31,47.74 17.56,47.74 | 15.09,50.08 14.97,50.08 | 15.09,50.08 15.09,50.87 17.25,53.03 17.25,56.73 SV1.4 17.27,71.49 26.7,80.92 28.15,80.92 29.78,82.54 31.71,82.54 32.32,81.93 32.32,80.64 IC5.11 32.4,78.77 v32.42,78.76 | 15.09,50.08 15.1,50.07 C1.1 | 23.25,47.74 23.25,48.56 24.67,49.98 25.11,49.98 IC3.1 | 16.25,46.22 17.58,46.22 17.58,47.72 17.56,47.74
  Top 0.61: SV1.4 17.27,58.69 arc-90 18.17,59.58 24.67,59.58 arc-90 33.94,50.31 33.94,50.06 v34.03,49.97 30.97,49.97 C5.2 29.22,50.09 | D1.C arc90 23.21,35.13 23.21,36.3 arc-90 23.32,36.42 v39.05,36.42
  Bottom 0.203: 15.73,15.84 15.7,15.82 | 8.76,25.1 8.72,25.09 | 6.26,30.41 6.23,30.4 | 5.42,58.9 5.37,58.92 | 22.75,81.49 22.73,81.53 | 27.79,84.34 27.78,84.37 | 20.18,11.97 20.05,12.06 | 3.44,47.17 3.44,47.41 | 10.45,69.33 10.47,69.36 | 41.32,3.4 41.33,3.42 | 47.2,1.28 47.17,1.3 LED24.A
  Bottom 0.254: v10.57,45.31 9.95,45.75 8.22,45.75
  Bottom 0.305: v9.72,41.67 8.22,42.92 8.22,45.75 11.03,48.56 11.03,52.23 9.52,53.74 4.15,53.74 | 18.36,13.55 v24.92,20.64
  Bottom 0.406: v32.42,78.76 32.78,78.39 C8.1 | LED23.A 41.33,3.42 35.68,4.52 | 30.07,6.29 LED21.A | 24.87,8.86 LED20.A | 20.05,12.06 LED19.A | LED18.A 15.7,15.82 11.94,20.21 | 11.94,20.21 LED17.A | LED16.A 8.72,25.09 6.26,30.41 | LED15.A 6.23,30.4 4.56,35.94 | 4.56,35.94 LED14.A | 3.6,41.59 LED13.A | 3.44,47.41 LED12.A | 4,53.15 LED11.A | LED10.A 5.37,58.92 7.56,64.25 | 7.56,64.25 LED9.A | 10.47,69.36 LED8.A | 18.12,78.06 LED6.A | LED5.A 22.73,81.53 27.79,84.34 | LED4.A 27.78,84.37 33.29,86.42 | 33.29,86.42 LED3.A | 38.84,87.78 LED2.A | LED1.A 44.62,88.31 38.84,87.78 | 13.95,73.96 LED7.A | 35.68,4.52 30.07,6.29 | 30.07,6.29 24.87,8.86 | 24.87,8.86 20.18,11.97 18.36,13.55 15.73,15.84 | 11.94,20.21 8.76,25.1 | 4.56,35.94 3.6,41.59 | 3.6,41.59 3.48,45.75 3.44,47.17 4,53.15 | 4,53.15 4.15,53.74 5.42,58.9 | 7.56,64.25 10.45,69.33 13.95,73.96 | 13.95,73.96 18.12,78.06 | 18.12,78.06 22.75,81.49 | 33.29,86.42 38.84,87.78 | 35.68,4.52 LED22.A | 47.17,1.3 45.07,3.4 41.46,3.4 41.32,3.4
  Bottom 0.61: 39.05,47.47 arc90 36.53,49.98 34.04,49.98 v34.03,49.97 | 39.05,47.47 39.05,43.2 | 39.05,47.47 39.05,47.52 arc90 36.58,49.98 | OUTPUT.3 INPUT.3 39.02,43.22 arc-90 39.05,43.2 | 39.05,43.2 v39.05,36.42 39.05,5.82 41.46,3.4
XLAT  (via drill 0.36)
  Top 0.254: 9.73,44.51 9.73,44.52 9.84,44.52 | 13.34,44.04 10.32,44.04 | 18.47,41.45 IC2.26
  Top 0.305: 9.73,44.51 IC1.26 | 10.32,44.04 9.84,44.52 | 13.34,44.04 13.49,43.88 13.49,42.82 16.16,40.15 16.76,40.15 v16.91,40.15 17.91,40.15 18.47,40.71 18.47,41.45
  Bottom 0.305: OUTPUT.6 33.74,40.15 v16.91,40.15
  Bottom 0.61: INPUT.6 OUTPUT.6

### Text on the board
tPlace: nullspacelabs.com | GND | MOSI | RST | VCC | SCK | MISO | + | + | MIC | NSL | [ | ]
bPlace: + | + | + | + | + | + | BT LED | + | That's not a blinky | + | This is BLINKY! | + | RST | + | Nikolai Nikitin | + | Inspired by | + | + | + | + | + | + | Mode | + | + | nullspacelabs.com | + | + | + | v2 | + | + | +